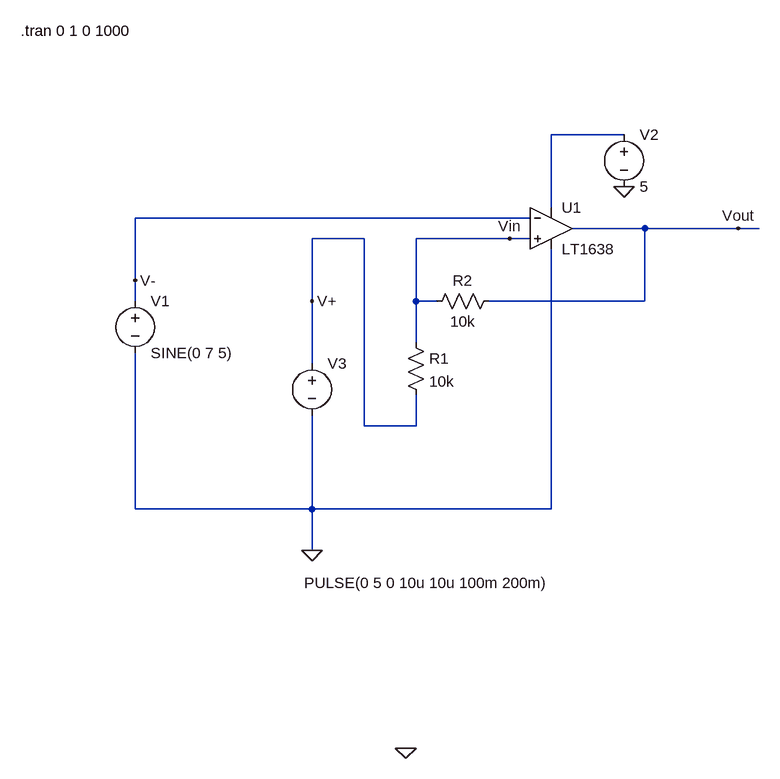
[diagram p0: schematic OP-AMP compactor.asc]
OP-AMP compactor.asc, the LTspice schematic file:
Version 4
SHEET 1 880 920
WIRE 352 -128 240 -128
WIRE 240 -16 240 -128
WIRE 208 0 -400 0
WIRE 384 16 272 16
WIRE 528 16 384 16
WIRE 560 16 528 16
WIRE -48 32 -128 32
WIRE 176 32 32 32
WIRE 208 32 176 32
WIRE -400 96 -400 0
WIRE -400 128 -400 96
WIRE -128 128 -128 32
WIRE 32 128 32 32
WIRE 64 128 32 128
WIRE 384 128 384 16
WIRE 384 128 144 128
WIRE 32 192 32 128
WIRE -128 224 -128 128
WIRE -48 320 -48 32
WIRE 32 320 32 272
WIRE 32 320 -48 320
WIRE -400 448 -400 208
WIRE -128 448 -128 304
WIRE -128 448 -400 448
WIRE 240 448 240 48
WIRE 240 448 -128 448
WIRE -128 512 -128 448
FLAG 16 816 0
FLAG -128 512 0
FLAG 528 16 Vout
FLAG -128 128 V+
FLAG -400 96 V-
FLAG 352 -48 0
FLAG 176 32 Vin
SYMBOL voltage 352 -144 R0
SYMATTR InstName V2
SYMATTR Value 5
SYMBOL res 16 176 R0
SYMATTR InstName R1
SYMATTR Value 10k
SYMBOL res 48 144 R270
WINDOW 0 32 56 VTop 2
WINDOW 3 0 56 VBottom 2
SYMATTR InstName R2
SYMATTR Value 10k
SYMBOL voltage -400 112 R0
WINDOW 123 0 0 Left 0
WINDOW 39 0 0 Left 0
SYMATTR InstName V1
SYMATTR Value SINE(0 7 5)
SYMBOL voltage -128 208 R0
WINDOW 3 -12 354 Left 2
WINDOW 123 0 0 Left 0
WINDOW 39 0 0 Left 0
SYMATTR Value PULSE(0 5 0 10u 10u 100m 200m)
SYMATTR InstName V3
SYMBOL OpAmps\\LT1638 240 -48 R0
SYMATTR InstName U1
TEXT -576 -288 Left 2 !.tran 0 1 0 1000

The netlist it stands for:
* OP-AMP compactor.asc
V2 N001 0 5
R1 Vin V+ 10k
R2 Vin Vout 10k
V1 V- 0 SINE(0 7 5)
V3 V+ 0 PULSE(0 5 0 10u 10u 100m 200m)
XU1 Vin V- N001 0 Vout LT1638  ; pins In+ In- V+ V- OUT
.tran 0 1 0 1000
.backanno
.end